# EAGLE design 02A-005 (EAGLE 9.6.2)
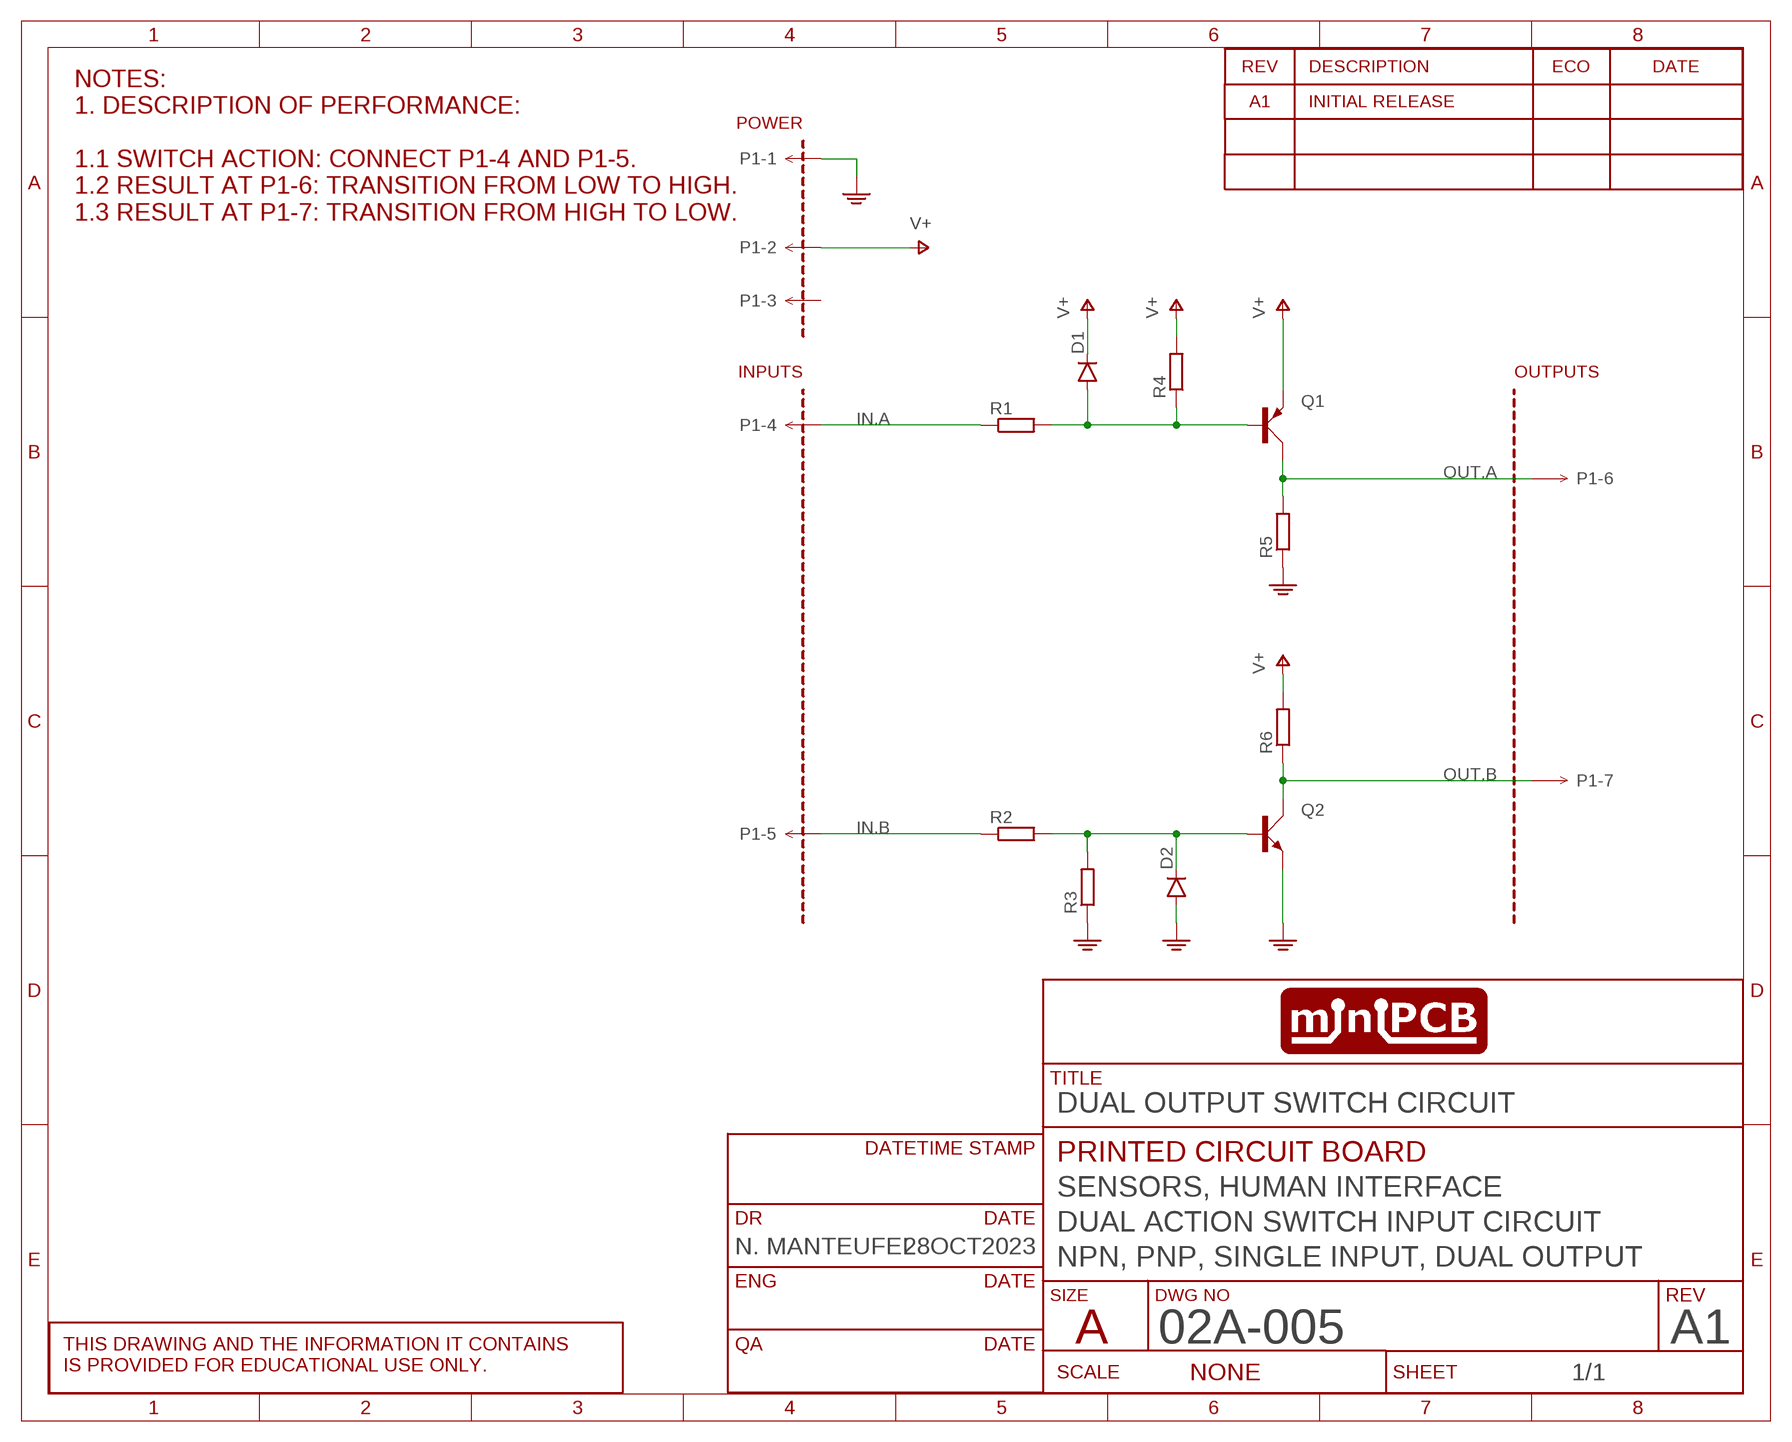
[diagram p0: schematic, sheet 1]
SHEET1 (SCHEMATIC): CIRCUIT_CATEGORY: SENSORS, HUMAN INTERFACE; CIRCUIT_NAME: DUAL ACTION SWITCH INPUT CIRCUIT; CIRCUIT_VARIANT: NPN, PNP, SINGLE INPUT, DUAL OUTPUT; DR: N. MANTEUFEL; DR_DATE: 28OCT2023; PCB_PCBA: PRINTED CIRCUIT BOARD; REVA: A1; REVISION: A1; TITLE: DUAL OUTPUT SWITCH CIRCUIT

## Parts
D1  DIODESMD  [DO214AC]
D2  DIODESMD  [DO214AC]
P1  MINIPCB_7P  [PINS_1X7]
PCB1  MINIPCB_0P00A-20X25  [MINIPCB_00A_20X25]
Q1  BJT_PNPBEC  [SOT23]
Q2  BJT_NPNBEC  [SOT23]
R1  RESISTORSMD  [R0805]
R2  RESISTORSMD  [R0805]
R3  RESISTORSMD  [R0805]
R4  RESISTORSMD  [R0805]
R5  RESISTORSMD  [R0805]
R6  RESISTORSMD  [R0805]

## Nets
GND: D2.A P1.1 Q2.2(E) R3.1 R5.1
IN.A: P1.4 R1.1
IN.A.PROTECTED: D1.A Q1.1(B) R1.2 R4.1
IN.B: P1.5 R2.1
IN.B.PROTECTED: D2.C Q2.1(B) R2.2 R3.2
OUT.A: P1.6 Q1.3(C) R5.2
OUT.B: P1.7 Q2.3(C) R6.1
V+: D1.C P1.2 Q1.2(E) R4.2 R6.2
Unconnected: P1.3

## Notes on the sheet
- NOTES:
  1. DESCRIPTION OF PERFORMANCE:
  
  1.1 SWITCH ACTION: CONNECT P1-4 AND P1-5.
  1.2 RESULT AT P1-6: TRANSITION FROM LOW TO HIGH.
  1.3 RESULT AT P1-7: TRANSITION FROM HIGH TO LOW.

## Library data of the parts
D1 D2 = minipcb:DIODE
P1 = minipcb:MINIPCB_7P
PCB1 = minipcb:MINIPCB_0P; CIRCUIT_CATEGORY: CIRCUIT CATEGORY; PART_NUMBER: 02A-005; REVISION: A1-01; TITLE: TITLE
Q1 = minipcb:BJT_PNP: TRANSISTOR
Q2 = minipcb:BJT_NPN: TRANSISTOR
R1-R6 = minipcb:RESISTOR

## Board
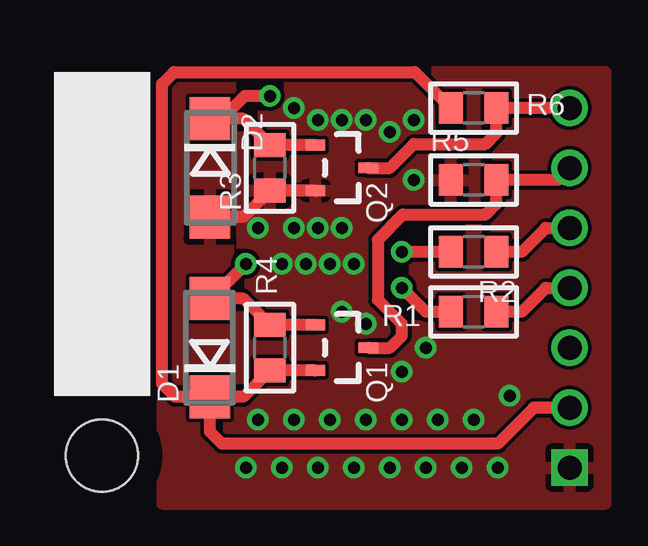
[diagram p1: board, top side]
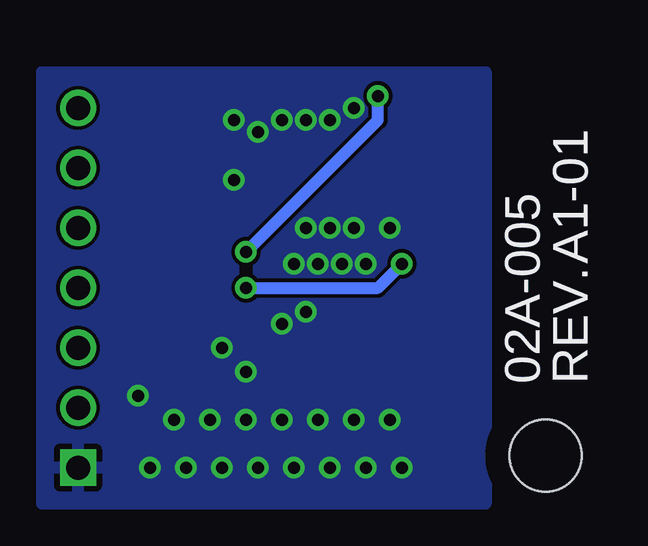
[diagram p2: board, bottom side, seen from below]

No outline drawn. Coordinates in mm, seen from the top.
Copper layers (1*16): Top 0.035mm / dielectric 1.5mm / Bottom 0.035mm
Design rules "default": minimum track width 6mil, minimum drill 0.35mm, track to track 6mil, track to pad 6mil, pad to pad 6mil, via to via 6mil, smd to smd 6mil, copper to edge 40mil, drill to drill 6mil, minimum pad ring 10mil, minimum via ring 8mil, stop-mask expansion 4mil, vias tented up to drill 0mil, thermal gap 10mil

### Footprints (pad centres in the part's own frame; a part is rotated, then mirrored left to right if it is on the bottom)
DO214AC = smd 1.8 x 1.7: A 2.05,0; C -2.05,0
PINS_1X7 = drill 1 square: 1 0,0 | drill 1: 2 2.5,0; 3 5,0; 4 7.5,0; 5 10,0; 6 12.5,0; 7 15,0
MINIPCB_00A_20X25 = hole 3: 3,3
SOT23 = smd 0.45 x 0.8: 1 -0.95,-1.1; 2 0.95,-1.1; 3 0,1.1
R0805 = smd 1 x 1.3: 1 -0.95,0; 2 0.95,0

### Placement (x,y rotation side)
D1  7.5,7.5 90 top
D2  7.5,15 270 top
P1  22.5,2.5 90 top
PCB1  0,0 0 top
Q1  13,7.5 270 top
Q2  13,15 270 top
R1  18.5,9 180 top
R2  18.5,11.5 180 top
R3  10,15 90 top
R4  10,7.5 270 top
R5  18.5,14.5 0 top
R6  18.5,17.5 180 top

### Tracks (layer width: path | path; a pad name or v marks a point on that pad's centre or on a via)
GND  (via drill 0.5)
  Top 0.5: Q2.2 R3.1 8.9,12.95 D2.A
  other vias: 11.5,11 12.5,11 13.5,11 10.5,11 13,9 14,8.5 16.5,7.5 15.5,6.5 9.5,12.5 11,12.5 12,12.5 13,12.5 11,17.5 12,17 13,17 14,17 15,16.5 16,17 16,14.5 9,2.5 10.5,2.5 12,2.5 13.5,2.5 15,2.5 16.5,2.5 18,2.5 19.5,2.5 9.5,4.5 11,4.5 12.5,4.5 14,4.5 15.5,4.5 17,4.5 18.5,4.5 20,5.5
  pour Top: 24,1 24,19 5.5,19 5.5,1
  pour Bottom: 5.5,1 24,1 24,19 5.5,19 5.5,1.5
IN.A
  Top 0.5: P1.4 21.5,10 20.5,9 R1.1
IN.A.PROTECTED  (via drill 0.5)
  Top 0.5: Q1.1 R4.1 8.9,9.55 D1.A 7.55,9.55 v9,11 | R1.2 16.5,9 v15.5,10
  Bottom 0.5: v15.5,10 10,10 v9,11
IN.B
  Top 0.5: R2.1 20.5,11.5 21.5,12.5 P1.5
IN.B.PROTECTED  (via drill 0.5)
  Top 0.5: Q2.1 R3.2 8.9,17.05 8,17.05 | 8,17.05 D2.C | R2.2 v15.5,11.5 | v10,18 8.95,18 8,17.05
  Bottom 0.5: v15.5,11.5 10,17 v10,18
OUT.A
  Top 0.5: P1.6 22,14.5 R5.2 19.45,13.5 19,13.05 15.55,13.05 14.5,12 14.5,9.5 15.5,8.5 15.5,8 15,7.5 Q1.3
OUT.B
  Top 0.5: P1.7 R6.1 19.45,16.45 19,16 16,16 15,15 Q2.3
V+
  Top 0.5: Q1.2 R4.2 8.9,5.45 D1.C | P1.2 21,5 19.5,3.5 8,3.5 7.5,4 D1.C | D1.C 6.05,5.45 5.5,6 5.5,18.5 6,19 16.05,19 R6.2